# EAGLE design WM_TriacSwitchModuleRev4 (EAGLE 7.5.0)
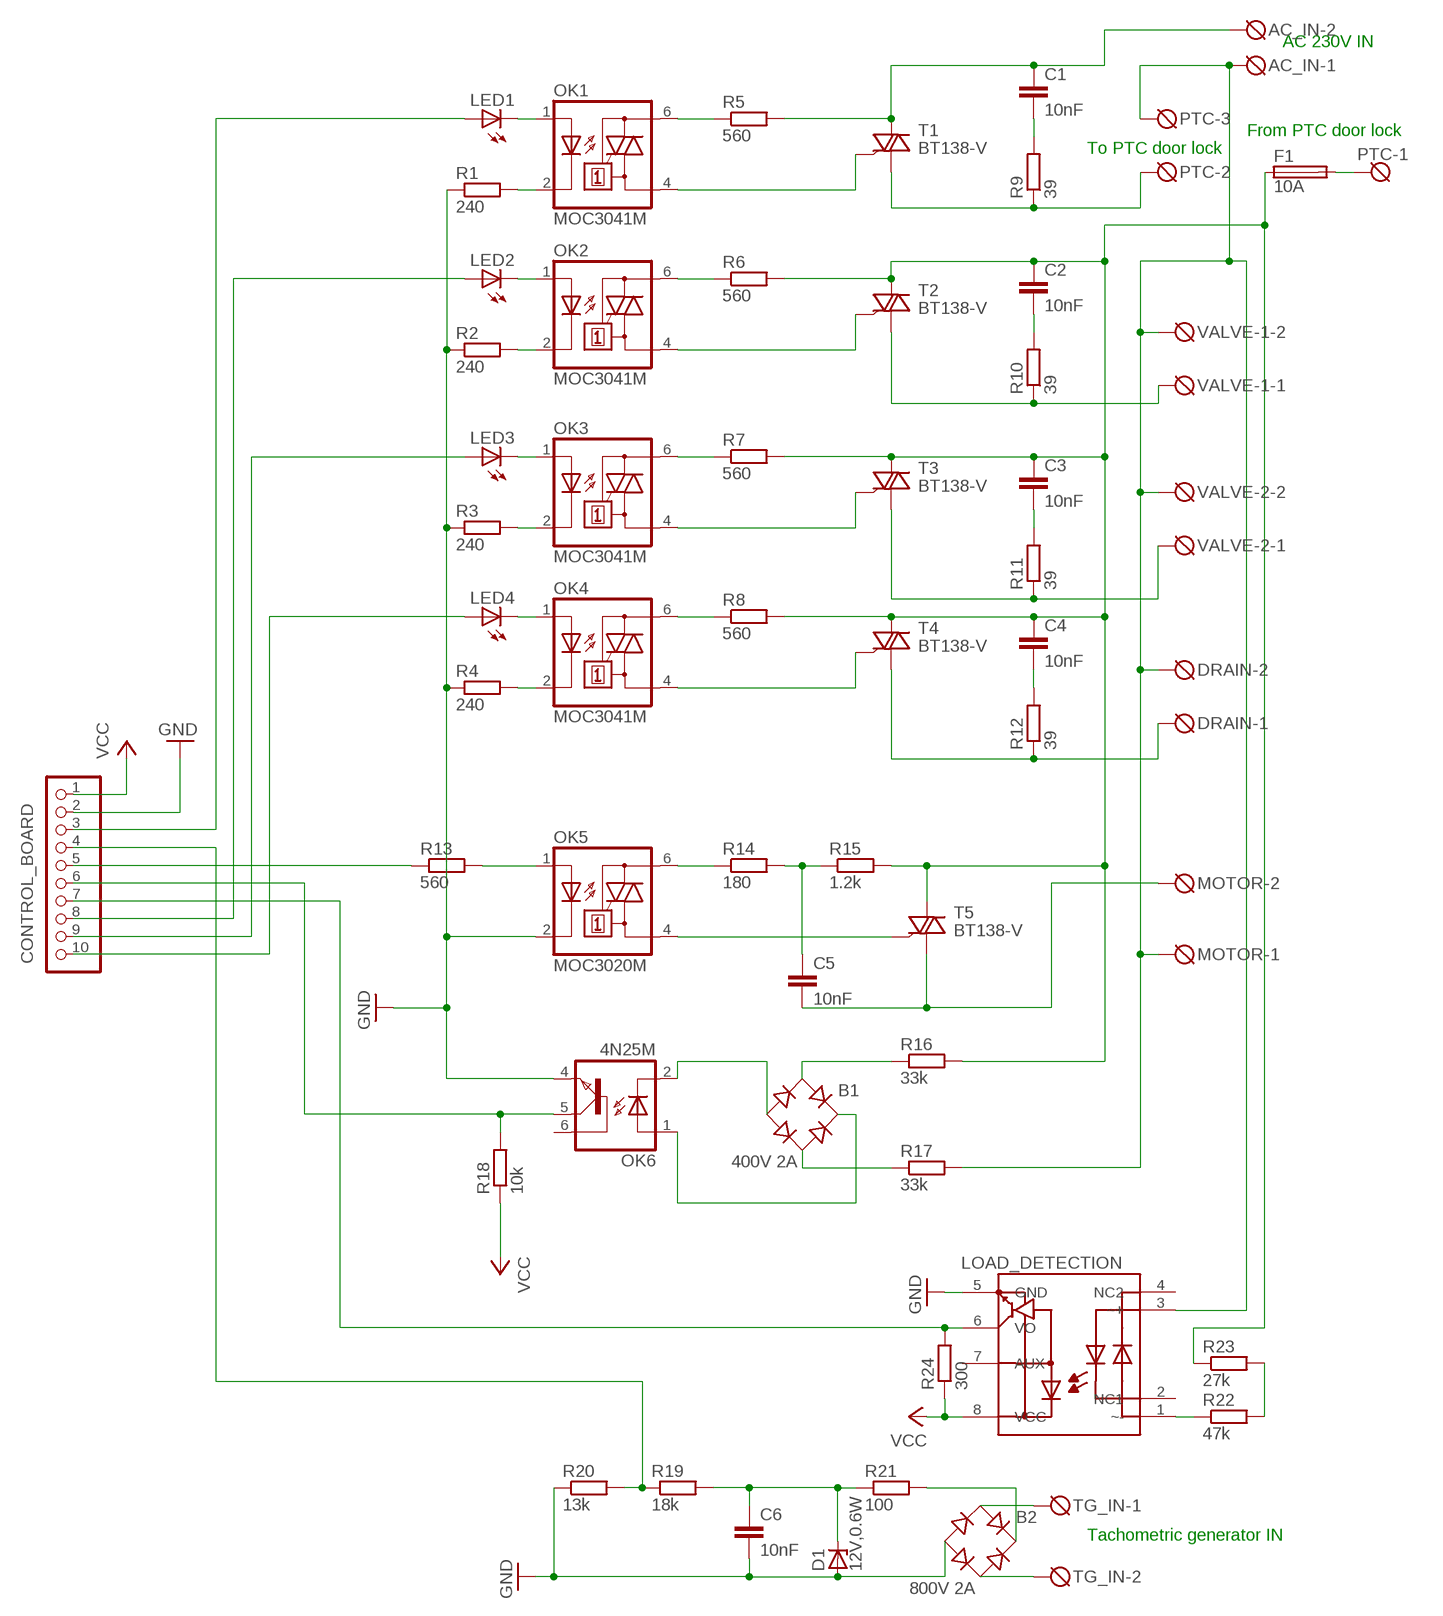
[diagram p0: schematic, sheet 1]

## Parts
AC_IN  N L  DG3XX-02-5.0  [DG306-5.0-02P]
B1  400V 2A  RB1A  [RB1A]
B2  800V 2A  RB1A  [RB1A]
C1  10nF  C-EU150-054X183  [C150-054X183]
C2  10nF  C-EU150-054X183  [C150-054X183]
C3  10nF  C-EU150-054X183  [C150-054X183]
C4  10nF  C-EU150-054X183  [C150-054X183]
C5  10nF  C-EU150-054X183  [C150-054X183]
C6  10nF  C-EU050-024X044  [C050-024X044]
CONTROL_BOARD  PINHD-1X10  [1X10-BIG]
D1  12V,0.6W  ZENER-DIODEDO35Z10  [DO35Z10]
DRAIN  L N  DG3XX-02-5.0  [DG306-5.0-02P]
F1  10A  FUSESH22,5  [SH22,5]
LED1  LEDCHIPLED_1206  [CHIPLED_1206]
LED2  LEDCHIPLED_1206  [CHIPLED_1206]
LED3  LEDCHIPLED_1206  [CHIPLED_1206]
LED4  LEDCHIPLED_1206  [CHIPLED_1206]
LOAD_DETECTION  MID400  [DIL08]
MOTOR  N L  DG3XX-02-5.0  [DG306-5.0-02P]
OK1  MOC3041M  [DIL06]
OK2  MOC3041M  [DIL06]
OK3  MOC3041M  [DIL06]
OK4  MOC3041M  [DIL06]
OK5  MOC3020M  [DIL06]
OK6  4N25M  [DIL06]
PTC  L_IN L_OUT N_OUT  DG3XX-03-5.0  [DG306-5.0-03P]
R1  240  R-EU_0207/10  [0207/10]
R2  240  R-EU_0207/10  [0207/10]
R3  240  R-EU_0207/10  [0207/10]
R4  240  R-EU_0207/10  [0207/10]
R5  560  R-EU_0207/10  [0207/10]
R6  560  R-EU_0207/10  [0207/10]
R7  560  R-EU_0207/10  [0207/10]
R8  560  R-EU_0207/10  [0207/10]
R9  39  R-EU_0207/10  [0207/10]
R10  39  R-EU_0207/10  [0207/10]
R11  39  R-EU_0207/10  [0207/10]
R12  39  R-EU_0207/10  [0207/10]
R13  560  R-EU_0207/10  [0207/10]
R14  180  R-EU_0207/10  [0207/10]
R15  1.2k  R-EU_0207/10  [0207/10]
R16  33k  R-EU_0207/10  [0207/10]
R17  33k  R-EU_0207/10  [0207/10]
R18  10k  R-EU_0207/10  [0207/10]
R19  18k  R-EU_0207/10  [0207/10]
R20  13k  R-EU_0207/10  [0207/10]
R21  100  R-EU_0207/10  [0207/10]
R22  47k  R-EU_0207/15  [0207/15]
R23  27k  R-EU_0207/15  [0207/15]
R24  300  R-EU_0207/10  [0207/10]
T1  BT138-V  [TO220BV]
T2  BT138-V  [TO220BV]
T3  BT138-V  [TO220BV]
T4  BT138-V  [TO220BV]
T5  BT138-V  [TO220BV]
TG_IN  DG3XX-02-5.0  [DG306-5.0-02P]
VALVE-1  L N  DG3XX-02-5.0  [DG306-5.0-02P]
VALVE-2  L N  DG3XX-02-5.0  [DG306-5.0-02P]

## Nets
GND: B2.- C6.2 CONTROL_BOARD.2 D1.A LOAD_DETECTION.5(GND) OK5.2(C) OK6.4(EMI) R1.1 R2.1 R3.1 R4.1 R20.1
N$1: LED1.C OK1.1(A)
N$2: LED2.C OK2.1(A)
N$3: LED3.C OK3.1(A)
N$4: LED4.C OK4.1(A)
N$5: OK1.2(C) R1.2
N$6: OK2.2(C) R2.2
N$7: OK3.2(C) R3.2
N$8: OK4.2(C) R4.2
N$9: AC_IN.1 DRAIN.2 LOAD_DETECTION.3(~+) MOTOR.1 PTC.3 R17.2 VALVE-1.2 VALVE-2.2
N$10: OK1.6(A2) R5.1
N$11: OK2.6(A2) R6.1
N$12: OK3.6(A2) R7.1
N$13: OK4.6(A2) R8.1
N$15: F1.2 PTC.1
N$16: B1.- OK6.2(C)
N$17: B1.AC1 R16.1
N$18: OK3.4(A1) T3.G
N$19: OK4.4(A1) T4.G
N$20: OK2.4(A1) T2.G
N$21: OK1.4(A1) T1.G
N$22: PTC.2 R9.1 T1.T1(A1)
N$23: R10.1 T2.T1(A1) VALVE-1.1
N$24: R11.1 T3.T1(A1) VALVE-2.1
N$25: DRAIN.1 R12.1 T4.T1(A1)
N$26: C1.2 R9.2
N$27: C2.2 R10.2
N$28: C3.2 R11.2
N$29: C4.2 R12.2
N$30: OK5.1(A) R13.2
N$31: OK5.6(A2) R14.1
N$32: C5.1 R14.2 R15.1
N$33: CONTROL_BOARD.6 OK6.5(COL) R18.2
N$34: OK5.4(A1) T5.G
N$35: B1.AC2 R17.1
N$36: C2.1 C3.1 C4.1 F1.1 R6.2 R7.2 R8.2 R15.2 R16.2 R23.1 T2.T2(A2) T3.T2(A2) T4.T2(A2) T5.T2(A2)
N$37: B2.AC1 TG_IN.1
N$38: B1.+ OK6.1(A)
N$39: B2.AC2 TG_IN.2
N$41: B2.+ R21.2
N$43: C6.1 D1.C R19.2 R21.1
N$44: LOAD_DETECTION.1(~-) R22.1
N$45: AC_IN.2 C1.1 R5.2 T1.T2(A2)
N$46: R22.2 R23.2
N$47: CONTROL_BOARD.3 LED1.A
N$48: CONTROL_BOARD.7 LOAD_DETECTION.6(VO) R24.2
N$49: CONTROL_BOARD.4 R19.1 R20.2
N$50: CONTROL_BOARD.5 R13.1
N$51: CONTROL_BOARD.8 LED2.A
N$52: CONTROL_BOARD.9 LED3.A
N$53: CONTROL_BOARD.10 LED4.A
N$58: C5.2 MOTOR.2 T5.T1(A1)
VCC: CONTROL_BOARD.1 LOAD_DETECTION.8(VCC) R18.1 R24.1
Unconnected: LOAD_DETECTION.2(NC1) LOAD_DETECTION.4(NC2) LOAD_DETECTION.7(AUX) OK6.6(BAS)

## Notes on the sheet
- AC 230V IN
- From PTC door lock
- To PTC door lock
- Tachometric generator IN

## Library data of the parts
AC_IN DRAIN MOTOR TG_IN VALVE-1 VALVE-2 = degson:DG3XX-02: DG350-3.5-02P DG306-5.0-02P
B1 B2 = rectifier:RB1A: RECTIFIER 1 A
C1-C5 = rcl:C-EU: CAPACITOR, European symbol
C6 = resistor:C-EU: CAPACITOR, European symbol
CONTROL_BOARD = adafruit:PINHD-1X10: Pin header 1x10 0.1" spacing With round pins
D1 = diode:ZENER-DIODE: Z-Diode
F1 = fuse:FUSE: Fuse; OC_FARNELL: unknown; OC_NEWARK: unknown
LED1-LED4 = adafruit:LED: LED OSRAM: - CHIPLED LG R971, LG N971, LY N971, LG Q971, LY Q971, LO R971, LY R971 LH N974, LH R974 LS Q976, LO Q976, LY Q976 LO Q996 - Hyper CHIPLED LW Q18S LB Q993, LB Q99A, LB R99A - SideLED LS A670, LO A670, LY A670, LG A670, LP A670 LB A673, LV A673, LT A673, LW A673 LH A674 LY A675 LS A676, LA A676, LO A676, LY A676, LW A676 LS A679, LY A679, LG A679 - Hyper Micro SIDELED® LS Y876, LA Y876, LO Y876, LY Y876 LT Y87S - SmartLED LW L88C, LW L88S LB L89C, LB L89S, LG L890 LS L89K, LO L89K, LY L89K LS L896, LA L896, LO L896, LY L896 - TOPLED LS T670, LO T670, LY T670, LG T670, LP T670 LSG T670, LSP T670, LSY T670, LOP T670, LYG T670 LG T671, LOG T671, LSG T671 LB T673, LV T673, LT T673, LW T673 LH T674 LS T676, LA T676, LO T676, LY T676, LB T676, LH T676, LSB T676, LW T676 LB T67C, LV T67C, LT T67C, LS T67K, LO T67K, LY T67K, LW E67C LS E67B, LA E67B, LO E67B, LY E67B, LB E67C, LV E67C, LT E67C LW T67C LS T679, LY T679, LG T679 LS T770, LO T770, LY T770, LG T770, LP T770 LB T773, LV T773, LT T773, LW T773 LH T774 LS E675, LA E675, LY E675, LS T675 LS T776, LA T776, LO T776, LY T776, LB T776 LHGB T686 LT T68C, LB T68C - Hyper Mini TOPLED® LB M676 - Mini TOPLED Santana® LG M470 LS M47K, LO M47K, LY M47K Source: http://www.osram.convergy.de/
LOAD_DETECTION = furnace_monitor:MID400
OK1-OK4 = optocoupler:MOC30*: 6-Pin DIP Zero-Cross Optoisolators Triac Driver Output (250/400 Volt Peak) Source: Data sheet <http://www.fairchildsemi.com/ds/MO/MOC3031M.pdf> The old path of data sheet not more available 2013-05-06.; MF: FAIRCHILD SEMICONDUCTOR; MPN: MOC3041M; OC_FARNELL: 1086677; OC_NEWARK: 78K6090
OK5 = optocoupler:MOC30*M: RANDOM-PHASE OPTOISOLATORS TRIAC DRIVER OUTPUT Source: http://www.fairchildsemi.com MOC3020-M.pdf; MF: FAIRCHILD SEMICONDUCTOR; MPN: MOC3020-M; OC_FARNELL: 1505425; OC_NEWARK: 72K8895
OK6 = optocoupler:4N*?M: General Purpose 6-Pin Phototransistor Optocouplers Source: http://www.fairchildsemi.com/ds/4N/4N35-M.pdf; MPN: 4N25-M; OC_FARNELL: 1021349; OC_NEWARK: 98K9084
PTC = degson:DG3XX-03: DG350-3.5-03P DG306-5.0-03P
R1-R21 R24 = resistor:R-EU_: RESISTOR, European symbol
R22 R23 = rcl:R-EU_: RESISTOR, European symbol
T1-T5 = triac:BT138: TRIAC Source: http://www.semiconductors.philips.com BT138_SERIES_2.pdf

## Net classes
0 default: width 0.762 mm, drill 0.305 mm, clearance 0.508 mm

## Board
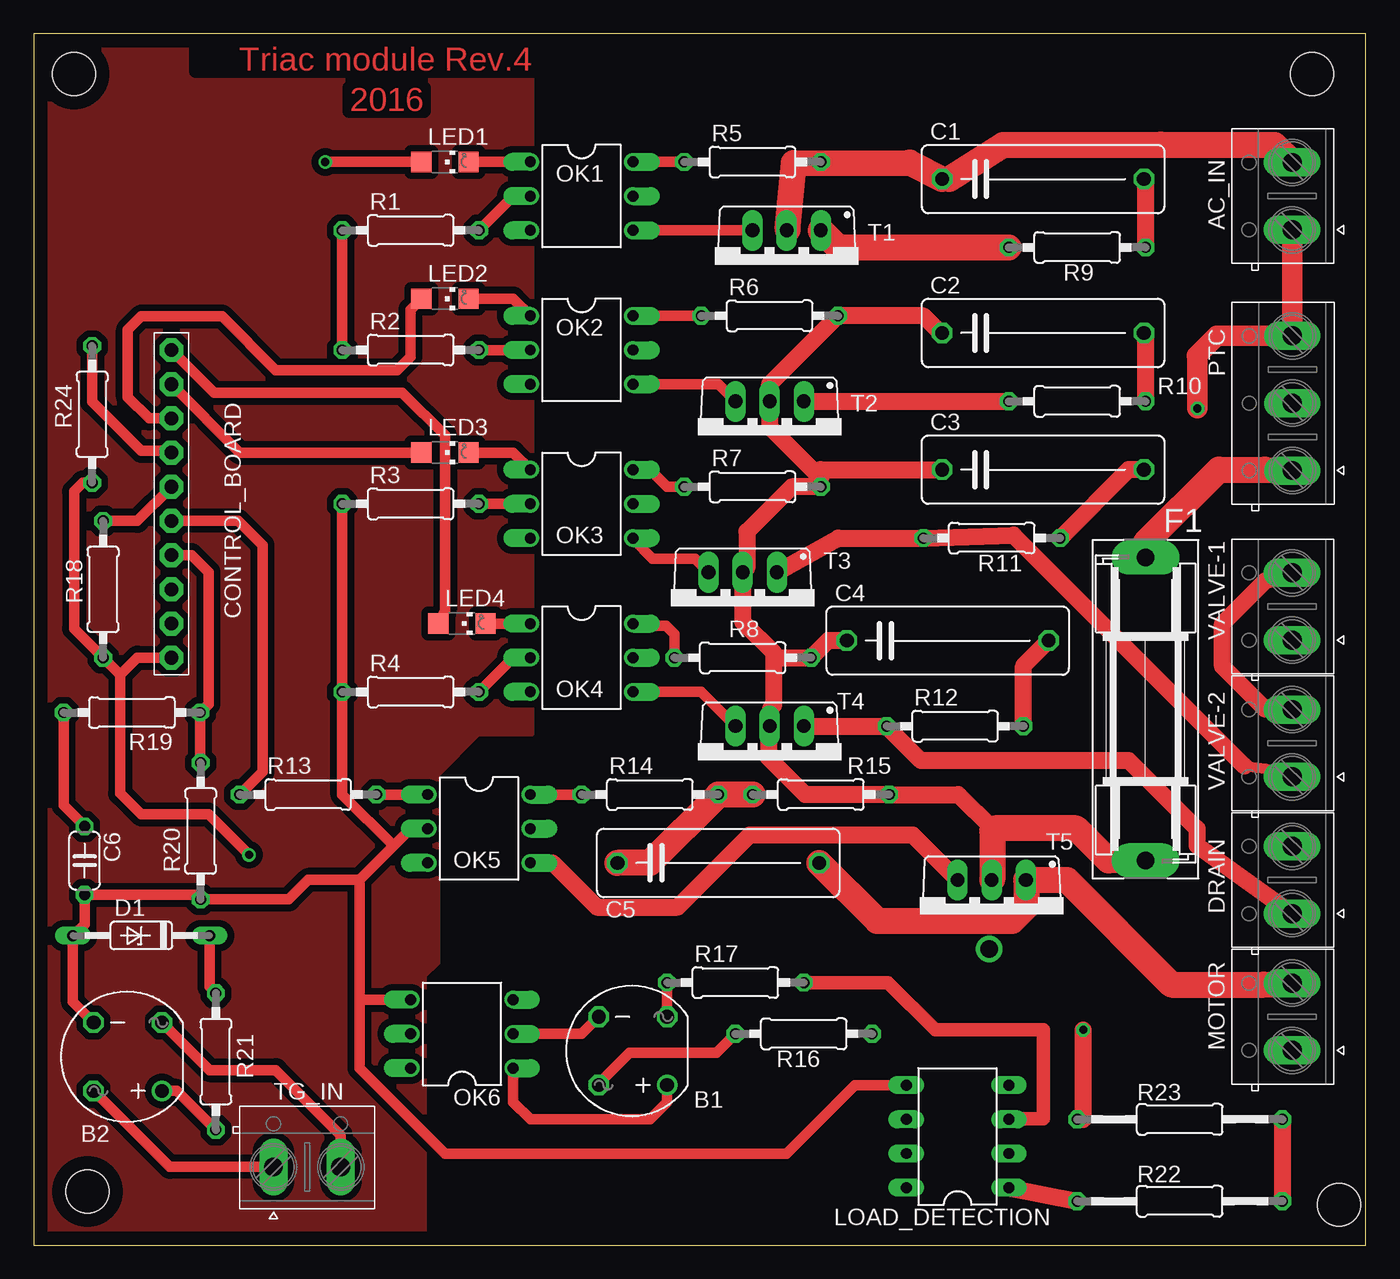
[diagram p1: board, top side]
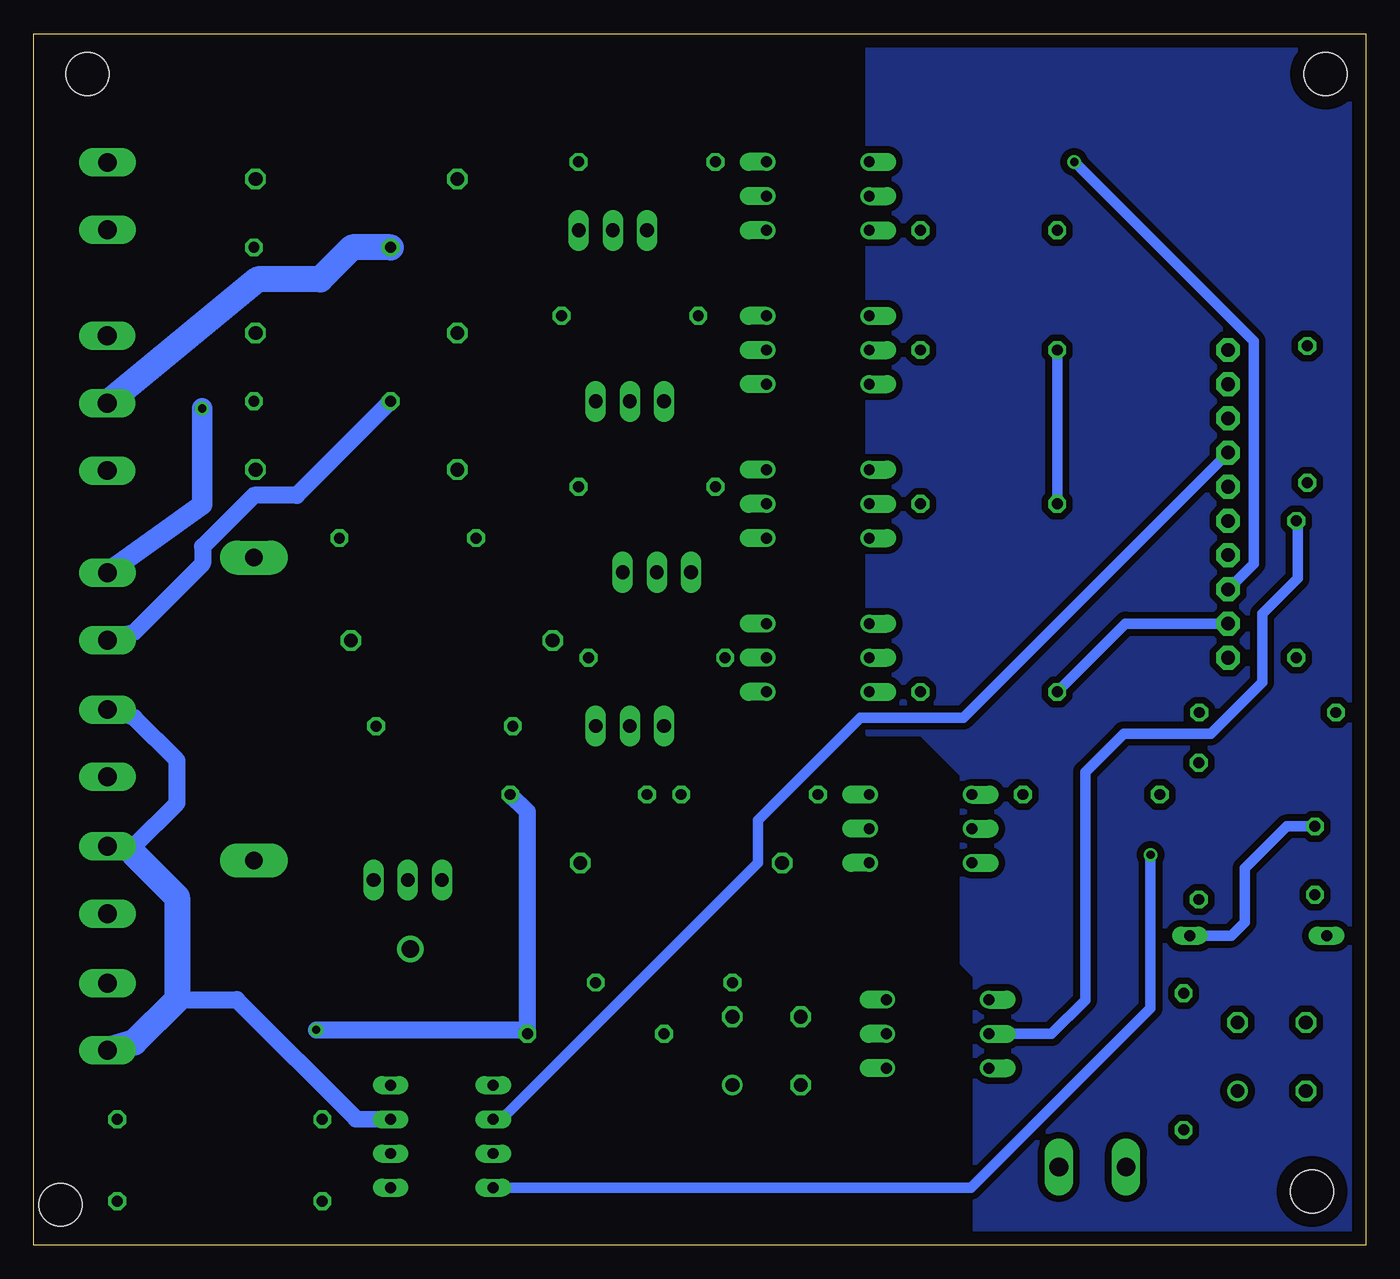
[diagram p2: board, bottom side, seen from below]

Size 99 x 90 mm. Coordinates in mm from the lower left corner, seen from the top.
Outline: 0,0 99,0 99,90 0,90 0,0
Copper layers (1*16): Top 0.035mm / dielectric 1.5mm / Bottom 0.035mm
Design rules "default": minimum track width 10mil, minimum drill 24mil, track to track 8mil, track to pad 8mil, pad to pad 8mil, via to via 8mil, smd to smd 8mil, copper to edge 40mil, drill to drill 8mil, minimum pad ring 10mil, minimum via ring 8mil, stop-mask expansion 4mil, vias tented up to drill 0mil, thermal gap 10mil
Holes 3.2 mm at 3,87 4,4 95,87 97,3

### Footprints (pad centres in the part's own frame; a part is rotated, then mirrored left to right if it is on the bottom)
DG306-5.0-02P = drill 1.4 long: 1 -2.5,0; 2 2.5,0
RB1A = drill 1.016: + -2.54,2.54 | drill 1.016 octagon: - 2.54,-2.54; AC1 2.54,2.54; AC2 -2.54,-2.54
C150-054X183 = drill 1.016 octagon: 1 -7.493,0; 2 7.493,0
C050-024X044 = drill 0.813 octagon: 1 -2.54,0; 2 2.54,0
1X10-BIG = drill 1.016 pad 1.778 octagon: 1 -11.43,0; 2 -8.89,0; 3 -6.35,0; 4 -3.81,0; 5 -1.27,0; 6 1.27,0; 7 3.81,0; 8 6.35,0; 9 8.89,0; 10 11.43,0
DO35Z10 = drill 0.813 long: A 5.08,0; C -5.08,0
SH22,5 = drill 1.321 pad 2.54 long: 1 -11.252,0; 2 11.252,0
CHIPLED_1206 = smd 1.5 x 1.5: A 0,-1.75; C 0,1.75
DIL08 = drill 0.813 long: 1 -3.81,-3.81; 2 -1.27,-3.81; 3 1.27,-3.81; 4 3.81,-3.81; 5 3.81,3.81; 6 1.27,3.81; 7 -1.27,3.81; 8 -3.81,3.81
DIL06 = drill 0.813 offset: 1 -2.54,-3.81; 2 0,-3.81; 3 2.54,-3.81; 4 2.54,3.81; 5 0,3.81; 6 -2.54,3.81
DG306-5.0-03P = drill 1.4 long: 1 -5,0; 2 0,0; 3 5,0
0207/10 = drill 0.813 octagon: 1 -5.08,0; 2 5.08,0
0207/15 = drill 0.813 octagon: 1 -7.62,0; 2 7.62,0
TO220BV = drill 1.016 long: G 2.54,-2.54; T1 -2.54,-2.54; T2 0,-2.54

### Placement (x,y rotation side)
AC_IN  93.52,77.93 90 top
B1  44.53,14.43 180 top
B2  7,14 180 top
C1  75.01,79.2 0 top
C2  75.01,67.77 0 top
C3  75.01,57.61 0 top
C4  67.93,44.91 0 top
C5  50.88,28.4 0 top
C6  3.78,28.57 270 top
CONTROL_BOARD  10.24,55.07 90 top
D1  8,23 180 top
DRAIN  93.52,27.13 90 top
F1  82.63,39.83 90 top
LED1  30.56,80.47 270 top
LED2  30.56,70.31 270 top
LED3  30.56,58.88 270 top
LED4  31.83,46.18 270 top
LOAD_DETECTION  68.66,8.08 90 top
MOTOR  93.52,16.97 90 top
OK1  40.72,77.93 270 top
OK2  40.72,66.5 270 top
OK3  40.72,55.07 270 top
OK4  40.72,43.64 270 top
OK5  33.1,30.94 270 top
OK6  31.83,15.7 90 top
PTC  93.54,62.55 90 top
R1  28.02,75.39 0 top
R2  28.02,66.5 0 top
R3  28.02,55.07 0 top
R4  28.02,41.1 0 top
R5  53.42,80.47 0 top
R6  54.69,69.04 0 top
R7  53.42,56.34 0 top
R8  52.69,43.64 0 top
R9  77.55,74.12 0 top
R10  77.55,62.69 0 top
R11  71.2,52.53 0 top
R12  68.47,38.56 0 top
R13  20.4,33.48 0 top
R14  45.8,33.48 0 top
R15  58.5,33.48 0 top
R16  57.23,15.7 0 top
R17  52.15,19.51 0 top
R18  5.16,48.72 90 top
R19  7.3,39.57 180 top
R20  12.41,30.76 90 top
R21  13.54,13.64 270 top
R22  85.17,3.27 0 top
R23  85.17,9.35 0 top
R24  4.35,61.72 90 top
T1  55.96,72.85 180 top
T2  54.69,60.15 180 top
T3  52.69,47.45 180 top
T4  54.69,36.02 180 top
T5  71.2,24.59 180 top
TG_IN  20.32,5.81 0 top
VALVE-1  93.52,47.45 90 top
VALVE-2  93.52,37.29 90 top

### Tracks (layer width: path | path; a pad name or v marks a point on that pad's centre or on a via)
GND
  Top 0.406: 24.21,26.92 24,27.13 | 3.92,25.89 C6.2 | 12.06,26.03 R20.1
  Top 0.762: R1.1 R2.1 | R3.1 R4.1 22.94,33.48 26.75,29.67 | 26.75,29.67 28.02,30.94 OK5.2 | 26.75,29.67 24.21,27.13 24,27.13 20.4,27.13 18.95,25.68 R20.1 | LOAD_DETECTION.5 61.04,11.89 55.96,6.81 30.56,6.81 24.21,13.16 24.21,18.24 | 24.21,18.24 OK6.4 | 24.21,18.24 24.21,26.92 | 12.06,26.03 C6.2 3.78,23.86 D1.A 2.92,18.08 B2.-
  Bottom 0.762: CONTROL_BOARD.2 17.86,46.18 R4.1 | R3.1 R2.1
N$1
  Top 0.762: OK1.1 LED1.C
N$2
  Top 0.762: LED2.C 35.64,70.31 OK2.1
N$3
  Top 0.762: LED3.C 35.64,58.88 OK3.1
N$4
  Top 0.762: OK4.1 LED4.C
N$5
  Top 0.762: R1.2 35.64,77.93 OK1.2
N$6
  Top 0.762: OK2.2 R2.2
N$7
  Top 0.762: OK3.2 R3.2
N$8
  Top 0.762: R4.2 35.64,43.64 OK4.2
N$9  (via drill 0.6)
  Top 0.406: 86.46,66.08 86.48,66.08 | 93.52,68.07 93,67.55 | 75,16 75.05,16 | 72.47,9.38 LOAD_DETECTION.3
  Top 0.762: 91.52,39.83 VALVE-2.2
  Top 1: R17.2 63.49,19.51 67,16 75,16 | 75.05,16 75.05,9.38 72.47,9.38
  Top 1.27: 91.52,39.83 88.34,43.01 88.34,46.18 91.52,49.35 VALVE-1.2
  Top 1.524: PTC.3 93,67.55 87.93,67.55 86.46,66.08 | 86.48,66.08 v86.48,62.15 | AC_IN.1 93.52,68.07
  Bottom 0.406: v86.48,62.15 86.46,62.15
  Bottom 0.762: 91.52,29.67 DRAIN.2
  Bottom 1.27: 91.52,29.04 DRAIN.2 | 91.52,29.67 88.34,32.84 88.34,36.02 91.52,39.2 VALVE-2.2 | LOAD_DETECTION.3 75.05,9.38 83.9,18.24 88.34,18.24
  Bottom 1.524: VALVE-1.2 86.46,55.01 86.46,62.15
  Bottom 1.93: 91.52,29.04 88.34,25.86 88.34,18.24 91.52,15.06 MOTOR.1
N$10
  Top 0.762: R5.1 OK1.6
N$11
  Top 0.762: R6.1 OK2.6
N$12
  Top 0.762: R7.1 47.07,56.34 45.8,57.61 OK3.6
N$13
  Top 0.762: R8.1 47.61,45.39 47,46 44.71,46 OK4.6
N$14
  pour Bottom: 0,0 29,0 29,20 30,21 30,35 33,38 37,38 37,90 0,90
N$15
  Top 1.93: F1.2 82.63,52.17 88.08,57.62 91.47,57.62 PTC.1
N$16
  Top 0.762: OK6.2 40.72,15.7 B1.-
N$17
  Top 0.406: B1.AC1 41.99,12.01
  Top 0.762: 41.99,12.01 44.28,14.3 50.75,14.3 R16.1
N$18
  Top 0.406: 44.53,52.47 OK3.4
  Top 0.762: T3.G 49.14,51 46,51 44.53,52.47
N$19
  Top 0.762: OK4.4 49.61,41.1 T4.G
N$20
  Top 0.762: OK2.4 50.88,63.96 T2.G
N$21
  Top 0.762: T1.G OK1.4
N$22
  Top 1.93: R9.1 59.77,74.12 T1.T1
  Bottom 1.93: R9.1 75.33,74.12 77.7,71.74 82.34,71.74 PTC.2
N$23
  Top 1.27: T2.T1 R10.1
  Bottom 1.27: R10.1 79.45,55.7 82.63,55.7 86.44,51.9 86.44,50.62 91.52,45.55 VALVE-1.1
N$24
  Top 0.762: 89.97,35.6 91.52,35.38 VALVE-2.1
  Top 1.27: T3.T1 59.77,52.53 R11.1 72.82,52.74 89.97,35.6
N$25
  Top 1.27: T4.T1 R12.1 65.95,36 81.38,36 86.44,30.94 86.44,29.71 DRAIN.1
N$26
  Top 0.762: 82.63,79.2 C1.2
  Top 1.27: 82.63,79.2 R9.2
N$27
  Top 0.762: 82.63,67.77 C2.2
  Top 1.27: 82.63,67.77 R10.2
N$28
  Top 1.27: R11.2 81.36,57.61 C3.2
N$29
  Top 1.27: R12.2 73.55,43.04 C4.2
N$30
  Top 0.762: OK5.1 R13.2
N$31
  Top 0.762: R14.1 OK5.6
N$32
  Top 1.93: R15.1 R14.2 45.8,28.4 C5.1
N$33
  Top 0.762: R18.2 7.7,53.8 CONTROL_BOARD.6
  Bottom 0.406: 5.07,53.7 R18.2 | 20.85,35.15 20.85,34.99
  Bottom 0.762: OK6.5 23.36,15.7 20.85,18.21 20.85,34.99 | 5.07,53.7 5.07,49.54 7.7,46.91 7.7,41.84 11.53,38 18,38 20.85,35.15
N$34
  Top 1.27: OK5.4 38.56,28.4 41.85,25.11 47.86,25.11 53.23,30.48 65.31,30.48 T5.G
N$35
  Top 0.762: B1.AC2 R17.1
N$36  (via drill 0.6)
  Top 0.406: 54.64,38.51 T4.T2 | 71.23,30.96 71.23,30.78 71.42,30.97 | 71.23,27.16 T5.T2 | T3.T2 52.69,50.53 | 55,44 55.36,43.64 | 54.77,39.88 55,40.11 | R23.1 78,9.35
  Top 0.762: 67.39,67.77 C2.1 | 58.5,57.61 58.5,56.98 R7.2
  Top 1.27: 54.77,39.88 T4.T2 | 67.39,67.77 66.12,69.04 R6.2 54.69,63.96 T2.T2 54.69,60.78 58.5,56.98 | 58.5,57.61 C3.1 | 54.64,38.51 54.64,36.19 57.34,33.48 R15.2 68.71,33.48 71.23,30.96 | 55.36,43.64 R8.2 59.04,44.91 C4.1 | 55,40.11 55,44 52.69,46.31 T3.T2 53,50.3 53,53 56.34,56.34 R7.2 | 78,9.35 v78,16
  Top 1.93: 71.23,30.78 71.23,27.16 | F1.1 79.87,28.58 77.48,30.97 71.42,30.97
  Bottom 0.406: 62.61,16 R16.2
  Bottom 1.27: R16.2 62.31,32.21 R15.2 | v78,16 62.61,16
N$37
  Top 0.762: TG_IN.1 10.11,5.81 B2.AC1
N$38
  Top 0.762: OK6.1 35.64,10.62 36.91,9.35 45.8,9.35 47.07,10.62 B1.+
N$39
  Top 0.762: B2.AC2 13.08,13 18,13 22.82,8.18 TG_IN.2
N$41
  Top 0.762: R21.2 10.64,11.46 B2.+
N$42  (via drill 1.3 pad 1.68)
  other vias: 71,22
N$43
  Top 0.762: R21.1 13.08,19.18 D1.C | C6.1 2.22,32.67 R19.2
  Bottom 0.762: C6.1 5.89,31.11 9,28 9,24 10,23 D1.C
N$44
  Top 1.27: LOAD_DETECTION.1 R22.1
N$45
  Top 0.762: T1.T2 56.03,75.45 | 83.74,81.75 83.9,81.74 | 68.03,79.2 C1.1
  Top 1.524: 65.1,80.43 R5.2
  Top 1.93: 56.03,75.45 56.49,80.38 65.1,80.43 C1.1 | 83.74,81.75 72.06,81.74 68.03,79.2 | 83.9,81.74 92.21,81.74 AC_IN.2
N$46
  Top 1.27: R23.2 R22.2
N$47  (via drill 0.61)
  Top 0.762: v21.67,80.47 LED1.A
  Bottom 0.762: v21.67,80.47 8.34,67.14 8.34,50.62 CONTROL_BOARD.3
N$48
  Top 0.406: 10.12,59 CONTROL_BOARD.7
  Top 0.762: R24.2 4.35,62.65 8,59 10.12,59
  Bottom 0.762: LOAD_DETECTION.6 64.22,9.35 45.16,28.4 45.16,31.57 37.55,39.2 29.93,39.2 CONTROL_BOARD.7
N$49
  Top 0.406: R20.2 12.38,35.87
  Top 0.762: 12.38,35.87 R19.1 13,40.19 13,50 11.74,51.26 CONTROL_BOARD.4
N$50
  Top 0.762: R13.1 17,35.16 17,52 15.2,53.8 CONTROL_BOARD.5
N$51
  Top 0.762: CONTROL_BOARD.8 8.58,61.42 7,63 7,68 8,69 14,69 18,65 27,65 28,66 28,69.5 LED2.A
N$52
  Top 0.762: LED3.A 15.32,58.88 CONTROL_BOARD.9
N$53
  Top 0.762: CONTROL_BOARD.10 13.41,63.33 27.39,63.33 30.56,60.15 30.56,47.18 LED4.A
N$55  (via drill 0.6)
  other vias: 16,29
N$57
  pour Top: 0,90 37,90 37,38 33,38 30,35 30,21 29,20 29,0 0,0
N$58
  Top 0.406: 73.8,27.07 T5.T1
  Top 1.93: T5.T1 76.78,27.13 84.55,19.37 91.42,19.37 MOTOR.2 | 73.8,27.07 73.8,25.16 72.72,24.09 62.69,24.09 C5.2
VCC  (via drill 0.6)
  Top 0.762: 6.43,42.37 R18.1 3,45.8 3,56 3.64,56.64 R24.1 | CONTROL_BOARD.1 7.7,43.64 6.43,42.37 | 6.43,42.37 6.43,33.57 8,32 13,32 v16,29
  Bottom 0.762: LOAD_DETECTION.8 29.34,4.27 16,17.61 v16,29

### Text on the board
Top: Triac module Rev.4 | 2016